# EAGLE design phrike (EAGLE 7.5.0)
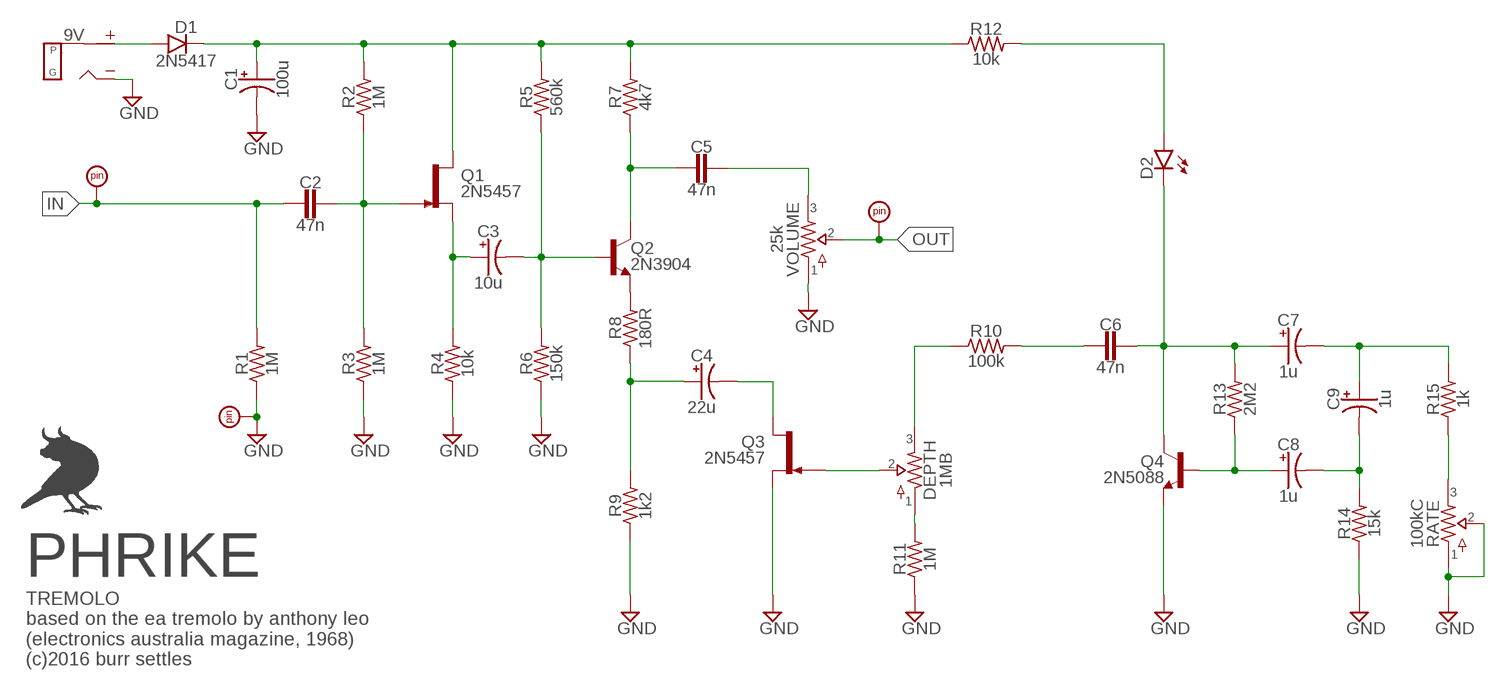
[diagram p0: schematic, sheet 1]

## Parts
9V  DC_MONO  [DC]
C1  100u  0631  [063_025]
C2  47n  CER/FILM2  [050X030_025_2]
C3  10u  0501  [050_020_1]
C4  22u  0501  [050_020_1]
C5  47n  CER/FILM2  [050X030_025_2]
C6  47n  CER/FILM2  [050X030_025_2]
C7  1u  0501  [050_020_1]
C8  1u  0501  [050_020_1]
C9  1u  0501  [050_020_1]
D1  2N5417  DO41.3  [DO41-3]
D2  LEDA  [3MM_A]
DEPTH  1MB  POTSTRIM  [2262_TRIM]
GND  PADRND  [ROUND]
IN  PADSQR  [SQUARE]
OUT  PADSQR  [SQUARE]
Q1  2N5457  [TO92-]
Q2  2N3904  2N3904L2  [TO92-L2]
Q3  2N5457  [TO92-]
Q4  2N5088  [TO92-]
R1  1M  R_.3B  [R0207/3]
R2  1M  R_.3B  [R0207/3]
R3  1M  R_.3B  [R0207/3]
R4  10k  R_.3B  [R0207/3]
R5  560k  R_.3B  [R0207/3]
R6  150k  R_.3B  [R0207/3]
R7  4k7  R_.3B  [R0207/3]
R8  180R  R_.3B  [R0207/3]
R9  1k2  R_.3B  [R0207/3]
R10  100k  R_.3B  [R0207/3]
R11  1M  R_.3B  [R0207/3]
R12  10k  R_.3B  [R0207/3]
R13  2M2  R_.3B  [R0207/3]
R14  15k  R_.3B  [R0207/3]
R15  1k  R_.3B  [R0207/3]
RATE  100kC  POTSSMALL_PADS  [PADS_SMALL]
VOLUME  25k  POTSTRIM  [2262_TRIM]

## Nets
+9V: 9V.T(TIP) D1.A
GND: 9V.S(SLEEVE) C1.- GND.1 Q3.2(S) Q4.3(E) R1.1 R3.1 R4.1 R6.1 R9.1 R11.1 R14.1 RATE.1 RATE.2 VOLUME.1
IN: C2.2 IN.1 R1.2
N$1: C2.1 Q1.1(G) R2.1 R3.2
N$2: C3.+ Q1.2(S) R4.2
N$3: C3.- Q2.2(B) R5.1 R6.2
N$4: C5.2 Q2.1(C) R7.1
N$5: Q2.3(E) R8.2
N$6: C5.1 VOLUME.3
N$7: C1.+ D1.C Q1.3(D) R2.2 R5.2 R7.2 R12.1
N$8: C4.+ R8.1 R9.2
N$9: C4.- Q3.3(D)
N$10: DEPTH.2 Q3.1(G)
N$11: DEPTH.3 R10.1
N$12: C6.2 R10.2
N$13: C6.1 C7.+ D2.K(C) Q4.1(C) R13.2
N$14: C8.+ Q4.2(B) R13.1
N$15: C7.- C9.+ R15.2
N$16: C8.- C9.- R14.2
N$17: DEPTH.1 R11.2
N$18: R15.1 RATE.3
N$19: D2.A R12.2
OUT: OUT.1 VOLUME.2

## Notes on the sheet
- PHRIKE
- TREMOLO
  based on the ea tremolo by anthony leo
  (electronics australia magazine, 1968)
  (c)2016 burr settles

## Library data of the parts
9V = jacks:DC_MONO
C1 = capacitors-elec:063: 33 - 220uF Xicon values at Mouser.com 10V: 220uF; 16V: 100uF; 25V: 100uF; 50V: 33uF
C2 C5 C6 = capacitors-film:CER/FILM: 47 - 120pF Xicon Ceramic Disc 2.5mm lead spacing
C3 C4 C7-C9 = capacitors-elec:050: 0.22 - 100uF Xicon values at Mouser.com: 10V: 10 - 100uF; 16V: 2.2 - 47uF; 25V: 0.47 - 47uF; 50V: 0.22 - 22uF
D1 = diodes:DO41: DO-41 Package Diodes: 1N4001 - 1N40019 Zener Diodes: 1N4728 - 1N4764
D2 = diodes:LED
DEPTH RATE VOLUME = potentiometers:POTS
GND IN OUT = supply pins:PAD
Q1 Q3 = transistors:2N5457: N-CHANNEL JFET
Q2 = transistors:2N3904: NPN Transistor
Q4 = transistors:2N5088: NPN Transistor
R1-R15 = resistors:R_

## Board
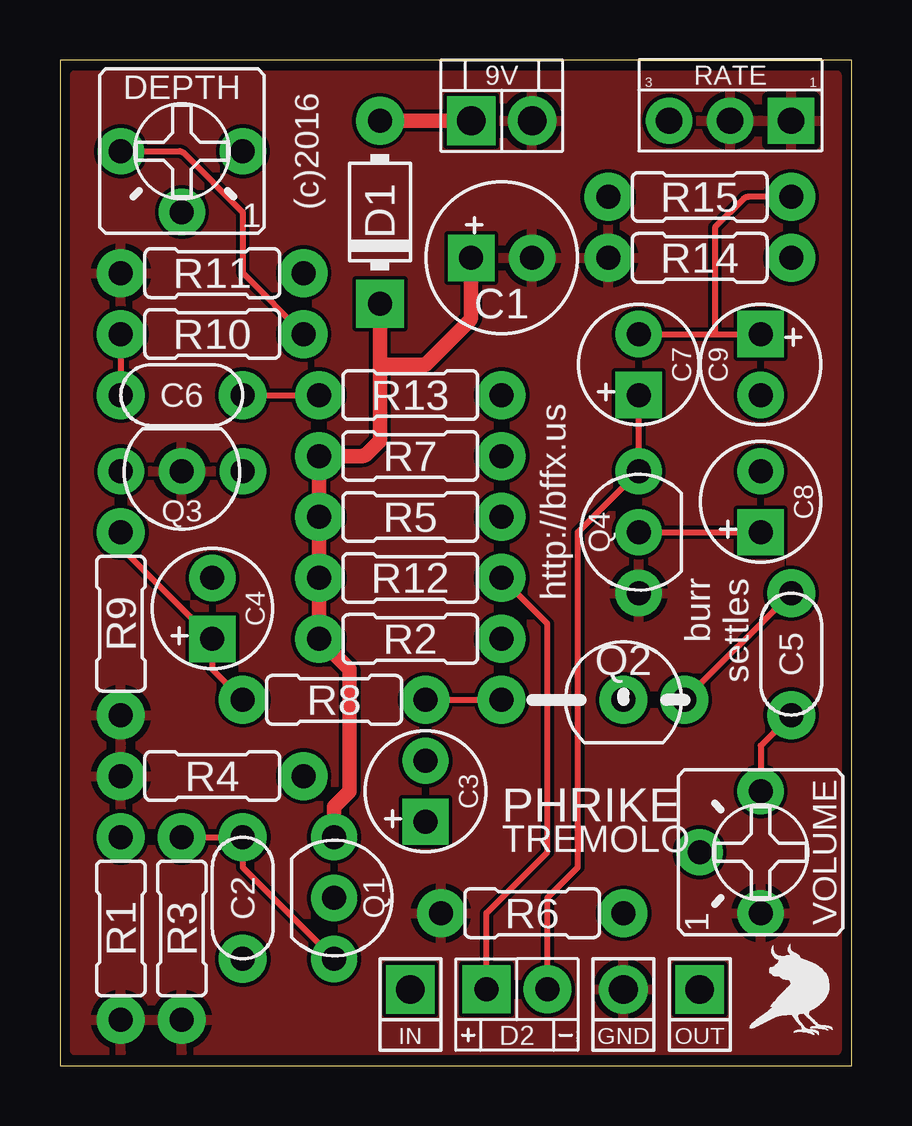
[diagram p1: board, top side]
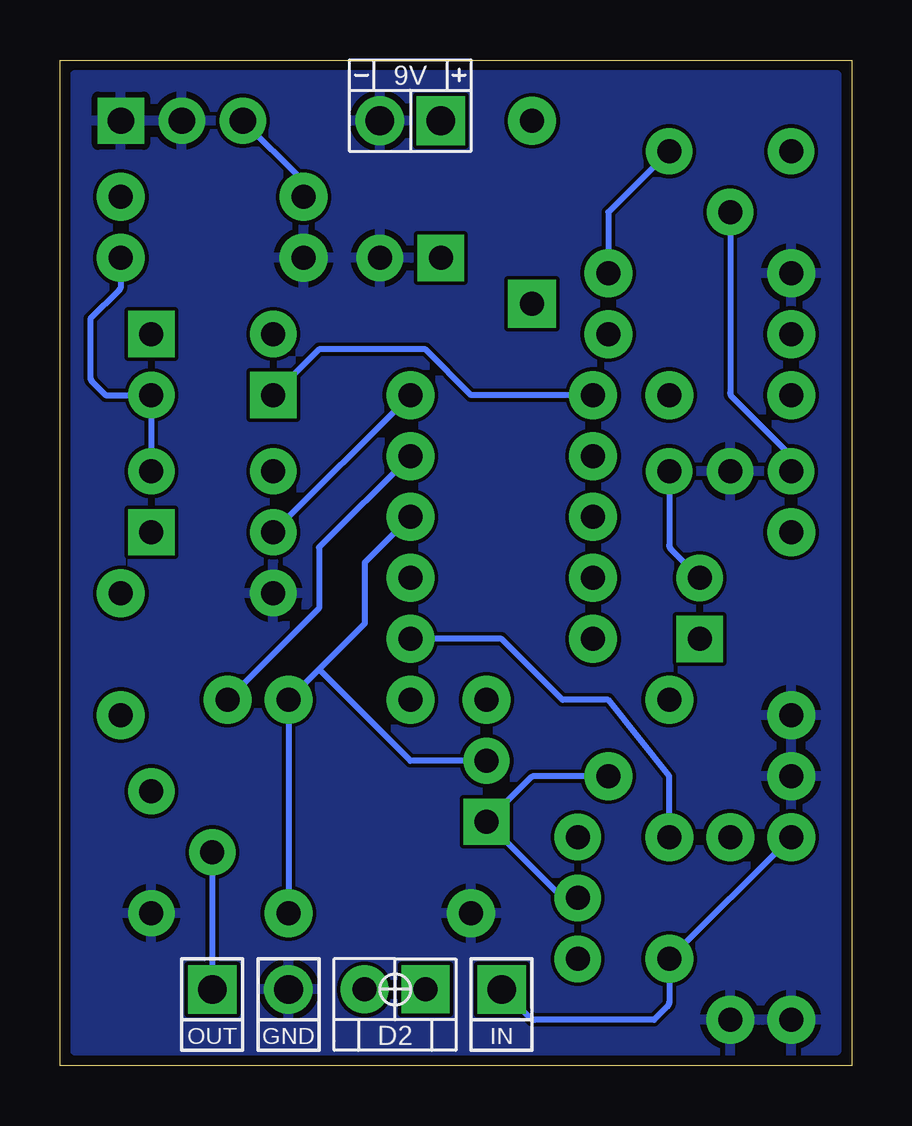
[diagram p2: board, bottom side, seen from below]

Size 33.02 x 41.9 mm. Coordinates in mm from the lower left corner, seen from the top.
Outline: 0,0 33.02,0 33.02,41.9 0,41.9 0,0
Copper layers (1*16): Top 0.0356mm / dielectric 1.5011mm / Bottom 0.0356mm
Design rules "oshpark-2layer": minimum track width 6mil, minimum drill 13mil, track to track 6mil, track to pad 6mil, pad to pad 6mil, via to via 6mil, smd to smd 6mil, copper to edge 15mil, drill to drill 6mil, minimum pad ring 7mil, minimum via ring 7mil, stop-mask expansion 2.5mil, vias tented up to drill 0mil, thermal gap 10mil

### Footprints (pad centres in the part's own frame; a part is rotated, then mirrored left to right if it is on the bottom)
DC = drill 1.2 pad 2.032: S -1.27,0 | drill 1.2 pad 2.032 square: T 1.27,0
063_025 = drill 1 pad 1.93 square: + -1.27,0 | drill 1 pad 1.93: - 1.27,0
050X030_025_2 = drill 1 pad 2: 1 -2.54,0; 2 2.54,0
050_020_1 = drill 1 pad 1.93 square: + -1.27,0 | drill 1 pad 1.93: - 1.27,0
DO41-3 = drill 1 pad 2: A 3.81,0 | drill 1 pad 2 square: C -3.81,0
3MM_A = drill 1 pad 2 square: A -1.27,0 | drill 1 pad 2: K 1.27,0
2262_TRIM = drill 1 pad 1.93: 1 -2.54,0; 2 0,2.54; 3 2.54,0
ROUND = drill 1.2 pad 2.032: 1 0,0
SQUARE = drill 1.2 pad 2.032 square: 1 0,0
TO92- = drill 1 pad 1.93: 1 2.54,0; 2 0,0; 3 -2.54,0
TO92-L2 = drill 1 pad 2: 1 2.54,0; 2 0,0; 3 -5.08,0
R0207/3 = drill 1 pad 2: 1 -3.81,0; 2 3.81,0
PADS_SMALL = drill 1.1 pad 1.93 square: 1 2.54,0 | drill 1.1 pad 1.93: 2 0,0; 3 -2.54,0

### Placement (x,y rotation side)
9V  18.41,39.37 0 bottom
C1  18.41,33.66 0 top
C2  7.62,6.99 270 top
C3  15.24,11.43 90 top
C4  6.35,19.05 90 top
C5  30.48,17.14 90 top
C6  5.08,27.94 180 top
C7  24.13,29.21 90 top
C8  29.21,23.5 90 top
C9  29.21,29.21 270 top
D1  13.34,35.56 90 top
D2  19.05,3.17 0 top
DEPTH  5.08,38.1 180 top
GND  23.5,3.17 0 top
IN  14.61,3.17 0 top
OUT  26.67,3.17 0 top
Q1  11.43,6.99 270 top
Q2  23.5,15.24 0 top
Q3  5.08,24.77 180 top
Q4  24.13,22.23 90 top
R1  2.54,5.71 90 top
R2  14.61,17.78 180 top
R3  5.08,5.71 90 top
R4  6.35,12.06 0 top
R5  14.61,22.86 180 top
R6  19.68,6.35 0 top
R7  14.61,25.4 180 top
R8  11.43,15.24 0 top
R9  2.54,18.41 90 top
R10  6.35,30.48 180 top
R11  6.35,33.02 0 top
R12  14.61,20.32 0 top
R13  14.61,27.94 180 top
R14  26.67,33.66 0 top
R15  26.67,36.2 0 top
RATE  27.94,39.37 0 top
U$1  [BF0150]  30.48,3.17 0 top
VOLUME  29.21,8.89 90 top

### Tracks (layer width: path | path; a pad name or v marks a point on that pad's centre or on a via)
+9V
  Top 0.61: 9V.T D1.A
GND
  pour Bottom: 0.64,41.27 32.38,41.27 32.38,0.64 0.64,0.64
  pour Top: 0.64,41.27 32.38,41.27 32.38,0.64 0.64,0.64
IN
  Bottom 0.254: R1.2 C2.2 7.62,2.65 arc45 7.69,2.47 8.26,1.91 13.23,1.91 arc45 13.41,1.98 IN.1
N$1
  Top 0.254: R3.2 C2.1 7.62,8.26 Q1.1
  Bottom 0.254: C2.1 7.62,12.06 10.16,15.24 12.06,15.24 14.61,17.78 R2.1
N$2
  Bottom 0.254: R4.2 13.23,12.06 arc-45 13.41,11.99 C3.+ 12.06,6.99 Q1.2
N$3
  Bottom 0.254: 22.23,16.51 20.32,18.41 20.32,20.95 R5.1 | 22.23,16.51 Q2.2 R6.2 | 22.23,16.51 18.41,12.7 C3.-
N$4
  Top 0.254: C5.2 Q2.1
  Bottom 0.254: Q2.1 22.23,19.05 22.23,21.59 R7.1
N$5
  Top 0.254: R8.2 Q2.3
N$6
  Top 0.254: VOLUME.3 29.21,13.34 C5.1
N$7
  Top 0.61: Q1.3 11.43,10.79 12.06,11.43 12.06,16.51 R2.2 R12.1 R5.2 R7.2 12.6,25.4 arc45 12.77,25.47 13.34,26.04 13.34,29.21 | C1.+ 17.14,31.22 arc-45 17.07,31.04 15.24,29.21 13.34,29.21 | 13.34,29.21 D1.C
N$8
  Top 0.254: R9.2 2.54,21.59 C4.+ 6.35,16.51 R8.1
N$9
  Bottom 0.254: Q3.3 7.62,21.7 arc-45 7.55,21.52 C4.-
N$10
  Bottom 0.254: DEPTH.2 5.08,28.05 arc-45 5.01,27.87 2.54,25.4 Q3.1
N$11
  Top 0.254: DEPTH.3 4.97,38.1 arc-45 5.15,38.03 7.62,35.56 7.62,33.12 arc45 7.69,32.95 R10.1
N$12
  Top 0.254: R10.2 C6.2
N$13
  Top 0.254: D2.K 20.32,6.99 21.59,8.26 21.59,22.23 Q4.1 C7.+ | C6.1 R13.2
  Bottom 0.254: R13.2 15.88,27.94 17.78,29.84 22.23,29.84 C7.+
N$14
  Top 0.254: Q4.2 C8.+
  Bottom 0.254: R13.1 Q4.2
N$15
  Top 0.254: C7.- 27.3,30.48 | 27.3,30.48 C9.+ | R15.2 28.68,36.2 arc45 28.5,36.12 27.3,34.92 27.3,30.48
N$16
  Bottom 0.254: C8.- C9.- 31.11,27.94 31.68,28.5 arc45 31.75,28.68 31.75,31.11 30.55,32.31 arc-45 30.48,32.49 R14.2
N$17
  Bottom 0.254: DEPTH.1 10.16,35.56 R11.2
N$18
  Bottom 0.254: R15.1 22.86,36.73 arc-45 22.93,36.9 RATE.3
N$19
  Top 0.254: D2.A 17.78,6.35 20.32,8.89 20.32,18.41 R12.2
OUT
  Bottom 0.254: VOLUME.2 OUT.1

### Text on the board
tNames: (c)2016 | http://bffx.us | burr / settles | PHRIKE | TREMOLO